# Altium schematic sheet STM32 Project 1B.SchDoc
size A4; SheetNumber: 1; SheetTotal: 5
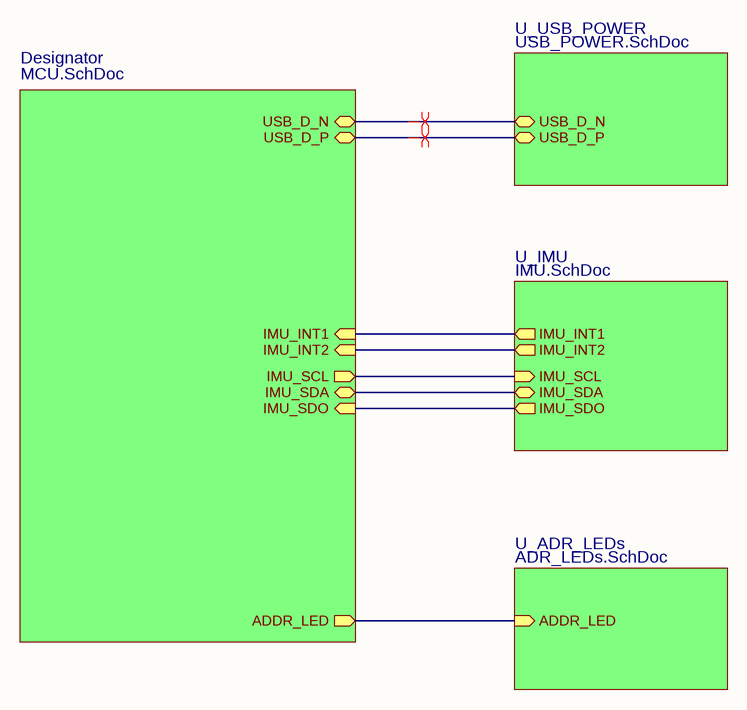
[diagram p0: STM32 Project 1B.SchDoc]

## Sub-sheets
Designator = MCU.SchDoc: USB_D_N (bidir), USB_D_P (bidir), IMU_INT1 (in), IMU_INT2 (in), IMU_SCL (out), IMU_SDA (bidir), IMU_SDO (in), ADDR_LED (out)
U_ADR_LEDs = ADR_LEDs.SchDoc: ADDR_LED (in)
U_IMU = IMU.SchDoc: IMU_INT1 (out), IMU_INT2 (out), IMU_SCL (in), IMU_SDA (bidir), IMU_SDO (out)
U_USB_POWER = USB_POWER.SchDoc: USB_D_N (bidir), USB_D_P (bidir)

## Nets
(unnamed): sheet Designator/USB_D_N, sheet U_USB_POWER/USB_D_N
(unnamed): sheet Designator/USB_D_P, sheet U_USB_POWER/USB_D_P
(unnamed): sheet Designator/IMU_INT1, sheet U_IMU/IMU_INT1
(unnamed): sheet Designator/IMU_INT2, sheet U_IMU/IMU_INT2
(unnamed): sheet Designator/IMU_SCL, sheet U_IMU/IMU_SCL
(unnamed): sheet Designator/IMU_SDA, sheet U_IMU/IMU_SDA
(unnamed): sheet Designator/IMU_SDO, sheet U_IMU/IMU_SDO
(unnamed): sheet Designator/ADDR_LED, sheet U_ADR_LEDs/ADDR_LED

## Layout directives
differential pair: (no net found under the mark)